# Altium schematic sheet 09_SHARED_PERIPHERAL.SchDoc: SENSEI Base Board - Shared Peripherals
size A3; DrawnBy: Sebastian Frey; Organization: Integrated Systems Laboratory; DocumentNumber: 10; Revision: v1.1; SheetNumber: 10; SheetTotal: 12
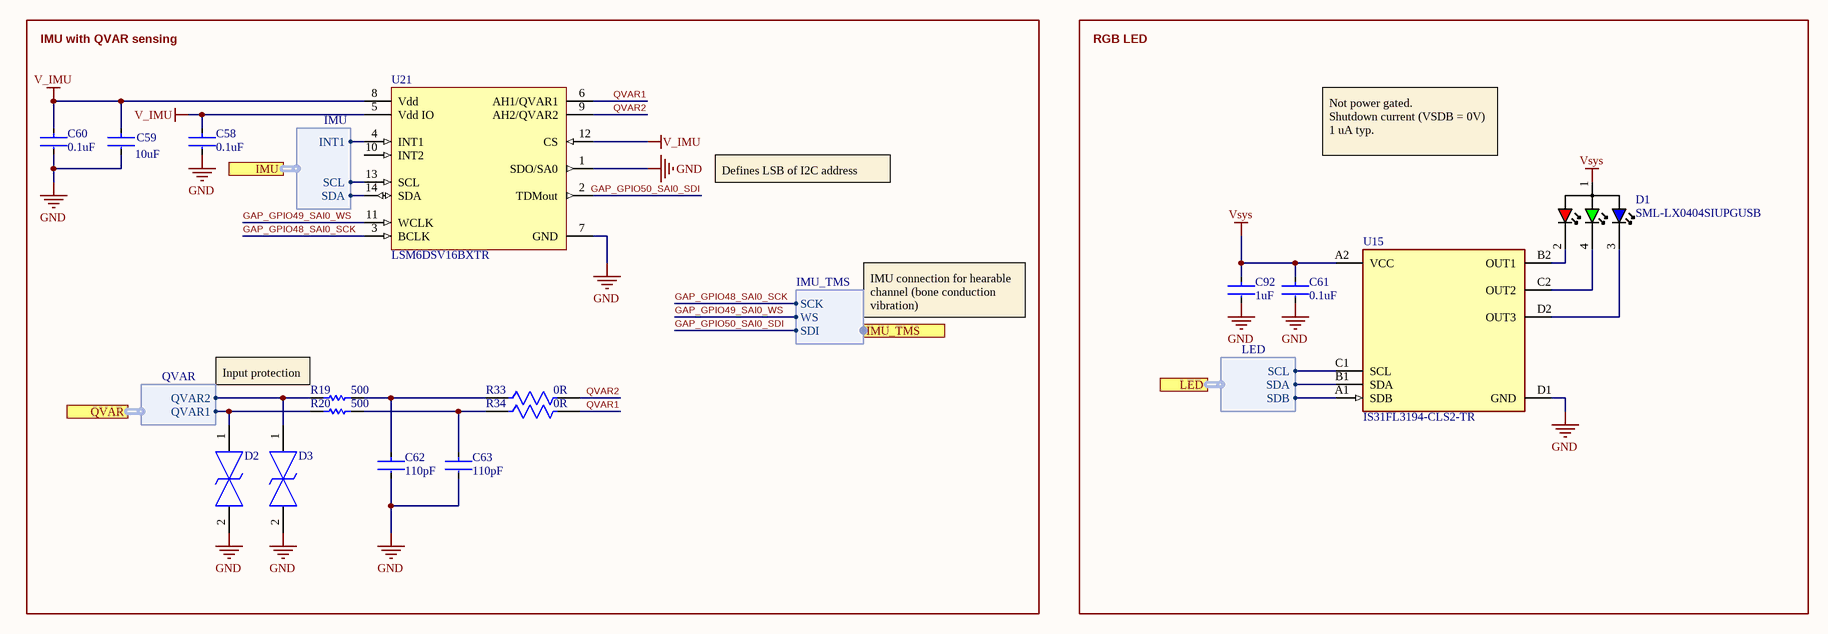
[diagram p0: 09_SHARED_PERIPHERAL.SchDoc]

## Parts
C58  Capacitance: 0.1uF  [FP-GRM033-0_03-IPC_C]  (hidden comment: GRM033Z71C104KE14D)
C59  Capacitance: 10uF  [FP-CL05A106MP5NUNC-IPC_C]  (hidden comment: CL05A106MP5NUNC)
C60  Capacitance: 0.1uF  [FP-GRM033-0_03-IPC_C]  (hidden comment: GRM033Z71C104KE14D)
C61  Capacitance: 0.1uF  [FP-GRM033-0_03-IPC_C]  (hidden comment: GRM033Z71C104KE14D)
C62  Capacitance: 110pF  [FP-GRM033-0_03-IPC_C]  (hidden comment: GRM0335C1H111JA01D)
C63  Capacitance: 110pF  [FP-GRM033-0_03-IPC_C]  (hidden comment: GRM0335C1H111JA01D)
C92  Capacitance: 1uF  [FP-CL03-IPC_C]  (hidden comment: CL03A105KP3NSNC)
D1  SML-LX0404SIUPGUSB  [SML-LX0404SIUPGUSB]
D2  TPD1E01B04DPYRQ1  [TPD1E01B04DPYRQ1]  (value not drawn)
D3  TPD1E01B04DPYRQ1  [TPD1E01B04DPYRQ1]  (value not drawn)
R19  Resistance: 500  [RESC0603X26X15LL03T05]  (hidden comment: ERJ-1GNF4990C)
R20  Resistance: 500  [RESC0603X26X15LL03T05]  (hidden comment: ERJ-1GNF4990C)
R33  Resistance: 0R  [FP-RMCF0402-IPC_C]  (hidden comment: RMCF0402ZT0R00)
R34  Resistance: 0R  [FP-RMCF0402-IPC_C]  (hidden comment: RMCF0402ZT0R00)
U15  IS31FL3194-CLS2-TR  [WLCSP_8_P0.4]
U21  LSM6DSV16BXTR  [FP-LGA-14L-DM00747677-MFG]

## Blocks framed on the sheet
IMU with QVAR sensing: C58-C60 C62 C63 D2 D3 R19 R20 R33 R34 U21
RGB LED: C61 C92 D1 U15

## Ports
IMU (harness IMU), IMU_TMS (harness IMU_TMS), LED (harness LED), QVAR (harness QVAR)

## Harnesses
LED: SCL, SDA, SDB
IMU: SCL, SDA, INT1
QVAR: QVAR2, QVAR1
IMU_TMS: SCK, WS, SDI

## Nets
GND: C58.2 C59.2 C60.2 C61.2 C62.2 C63.2 C92.2 D2.2 D3.2 U15.D1(GND) U21.1(SDO/SA0) U21.7(GND)
V_IMU: C58.1 C59.1 C60.1 U21.5(Vdd_IO) U21.8(Vdd) U21.12(CS)
Vsys: C61.1 C92.1 D1.1(Common_Anode) U15.A2(VCC)
GAP_GPIO48_SAI0_SCK: U21.3(BCLK) ; port IMU_TMS.SCK
GAP_GPIO49_SAI0_WS: U21.11(WCLK) ; port IMU_TMS.WS
GAP_GPIO50_SAI0_SDI: U21.2(TDMout) ; port IMU_TMS.SDI
QVAR1: R34.2 U21.6(AH1/QVAR1)
QVAR2: R33.2 U21.9(AH2/QVAR2)
NetC62_1: C62.1 R19.2 R33.1
NetC63_1: C63.1 R20.2 R34.1
NetD1_2: D1.2(Red_C) U15.B2(OUT1)
NetD1_3: D1.3(Blue_C) U15.D2(OUT3)
NetD1_4: D1.4(Green_C) U15.C2(OUT2)
NetD2_1: D2.1 R20.1 ; port QVAR.QVAR1
NetD3_1: D3.1 R19.1 ; port QVAR.QVAR2
NetU15_A1: U15.A1(SDB) ; port LED.SDB
NetU15_B1: U15.B1(SDA) ; port LED.SDA
NetU15_C1: U15.C1(SCL) ; port LED.SCL
NetU21_4: U21.4(INT1) ; port IMU.INT1
NetU21_13: U21.13(SCL) ; port IMU.SCL
NetU21_14: U21.14(SDA) ; port IMU.SDA

Not connected (* = marked no-connect by the designer): U21 10(INT2)

## Notes on the sheet
- Defines LSB of I2C address
- Not power gated.
  Shutdown current (VSDB = 0V) 1 uA typ.
- IMU connection for hearable channel (bone conduction vibration)
- Input protection
- 1
- 2
- 3
- 4
- 5
- 6
- 7
- 8
- A
- B
- C
- D
- Project:
- Date:
- Drawing number:
- Rev:
- Format:
- A3
- Drawn by:
- Laboratory:
- Page
- Sheet:
- of
- File:

## Library data of the parts
C58 C60 C61 = CMP-06035-035508-1: Chip Multilayer Ceramic Capacitors for General Purpose, 0201, 0.10uF, X7R, 15%, 10%, 16V; Case/Package: 0201
C59 = CMP-13271-000002-1: CAP CER 10UF 10V X5R 0402; Manufacturer: Samsung; Temperature Coefficient: 15%; Tolerance: 20%; Material: Ceramic; Octopart: https://octopart.com/cl05a106mp5nunc-samsung-22457395; Voltage Rating: 10V; RoHS: TRUE; Value: 10uF; Height: 0.7mm; Digikey Description: CAP CER 10UF 10V X5R 0402; Automotive: No; Package: CL05A106MP5NUNC; Device Class L1: Passive Components; Temperature Range High: +85°C; ComponentLink2Description: Datasheet; Device Class L2: Capacitors; Temperature Characteristic: X5R; Manufacturer Part Number: CL05A106MP5NUNC; Temperature: -55°C to +85°C; ComponentLink2URL: http://www.samsungsem.com/kr/support/product-search/mlcc/__icsFiles/afieldfile/2019/05/10/19-CL05A106MP5NUNC.pdf; Device Class L3: Ceramic Capacitors; Category: Cap; Temperature Range Low: -55°C; Ipc Land Pattern Name: CAPC10050X50; Lead Free: Yes
C62 C63 = CMP-06035-019132-1: Chip Multilayer Ceramic Capacitors for General Purpose, 0201, 110pF, C0G, 30ppm/°C, 5%, 50V; Weight: 1.2E-05oz; Case/Package: 0201; Voltage Rating (DC): 50V; Voltage Rating: 50V; Height: 0.3mm; Mount: Surface Mount; Thickness: 0.013inch; Case Code (Metric): 0603; Packaging: Tape and Reel; Case Code (Imperial): 0201; Termination: SMD/SMT; Max Operating Temperature: 125°C; Min Operating Temperature: -55°C; Width: 0.3mm; Dielectric: C0G; Length: 0.024inch; Package Quantity: 1; Tolerance: 5%
C92 = CMP-13271-003594-1: Cap Ceramic 1uF 10V X5R ±10% Pad SMD 0201 +85°C T/R; Min Operating Temperature: -55°C; Mount: Surface Mount; Packaging: Cut Tape; Width: 0.012inch; Tolerance: 10%; Case Code (Imperial): 0201; Thickness: 0.013inch; Length: 0.024inch; Case/Package: 0201; Max Operating Temperature: 85°C; Voltage Rating: 10V; Case Code (Metric): 0603
D1 = D_RGB_LED: SML-LX0404SIUPGUSB RGB LED; Manufacturer: Lumex; Supplier 1: Mouser; Manufacturer Part Number: SML-LX0404SIUPGUSB; Supplier Part Number 1: 696-LX0404SIUPGUSB
D2 D3 = TPD1E01B04DPYRQ1: TVS Diode (Bi-directional); Manufacturer_Name: Texas Instruments; Datasheet Link: https://www.ti.com/lit/ds/symlink/tpd1e01b04-q1.pdf?ts=1677834076075&ref_url=https%253A%252F%252Fwww.ti.com%252Fproduct%252FTPD1E01B04-Q1%252Fpart-details%252FTPD1E01B04DPYRQ1; Height: 0.45mm; Manufacturer_Part_Number: TPD1E01B04DPYRQ1; Mouser Part Number: 595-TPD1E01B04DPYRQ1; Mouser Price/Stock: https://www.mouser.co.uk/ProductDetail/Texas-Instruments/TPD1E01B04DPYRQ1?qs=doiCPypUmgEwTnvBpZhkOw%3D%3D; Arrow Part Number: TPD1E01B04DPYRQ1; Arrow Price/Stock: https://www.arrow.com/en/products/tpd1e01b04dpyrq1/texas-instruments?region=nac
R19 R20 = CMP-2004-03369-1: Manufacturer: Panasonic; Part Number: ERJ-1GNF4990C
R33 R34 = CMP-26527-007617-1: RES 0 OHM JUMPER 1/16W 0402; Power Rating: 63mW; Working Voltage: 50V; Current Rating: 1A; Series: RMCF; RoHS Compliant: Yes; Features: Automotive AEC-Q200; Width: 0.02inch; Depth: 0.5mm; Resistor Type: Thick Film; Number of Terminations: 2; Radiation Hardening: No; Length: 0.039inch; Contact Plating: Tin; Case/Package: 0402; Min Operating Temperature: -55°C; Case Code (Metric): 1005; Construction: Rectangular; Mount: Surface Mount; Max Operating Temperature: 155°C; Max Power Dissipation: 63mW; Height: 0.016inch; Lead Free: Lead Free; Packaging: Tape and Reel; Technology: THICK FILM; Case Code (Imperial): 0402; Military Standard: Not
U15 = IS31FL3194: LED Driver with Programmable Pattern Sequencing 3-Channel 40mA 8-Pin WCSP T/R; Manufacturer: ISSI; Supplier 1: Digi-Key; Manufacturer Part Number: IS31FL3194-CLS2-TR; Supplier Part Number 1: 2521-IS31FL3194-CLS2-TRCT-ND
U21 = CMP-00355-129901550-1: LSM6DSV16BXTR Inemo Inertial Module, 3.6V, Smd, Mems Module FunctionTri-Axis Gyroscope; Min Supply Voltage: 1.08V; Operating Supply Current: 950µA; NexarPartId: 129901550; Min Operating Temperature: -40°C; Max Supply Voltage: 3.6V; Height: 740µm; Max Operating Temperature: 85°C